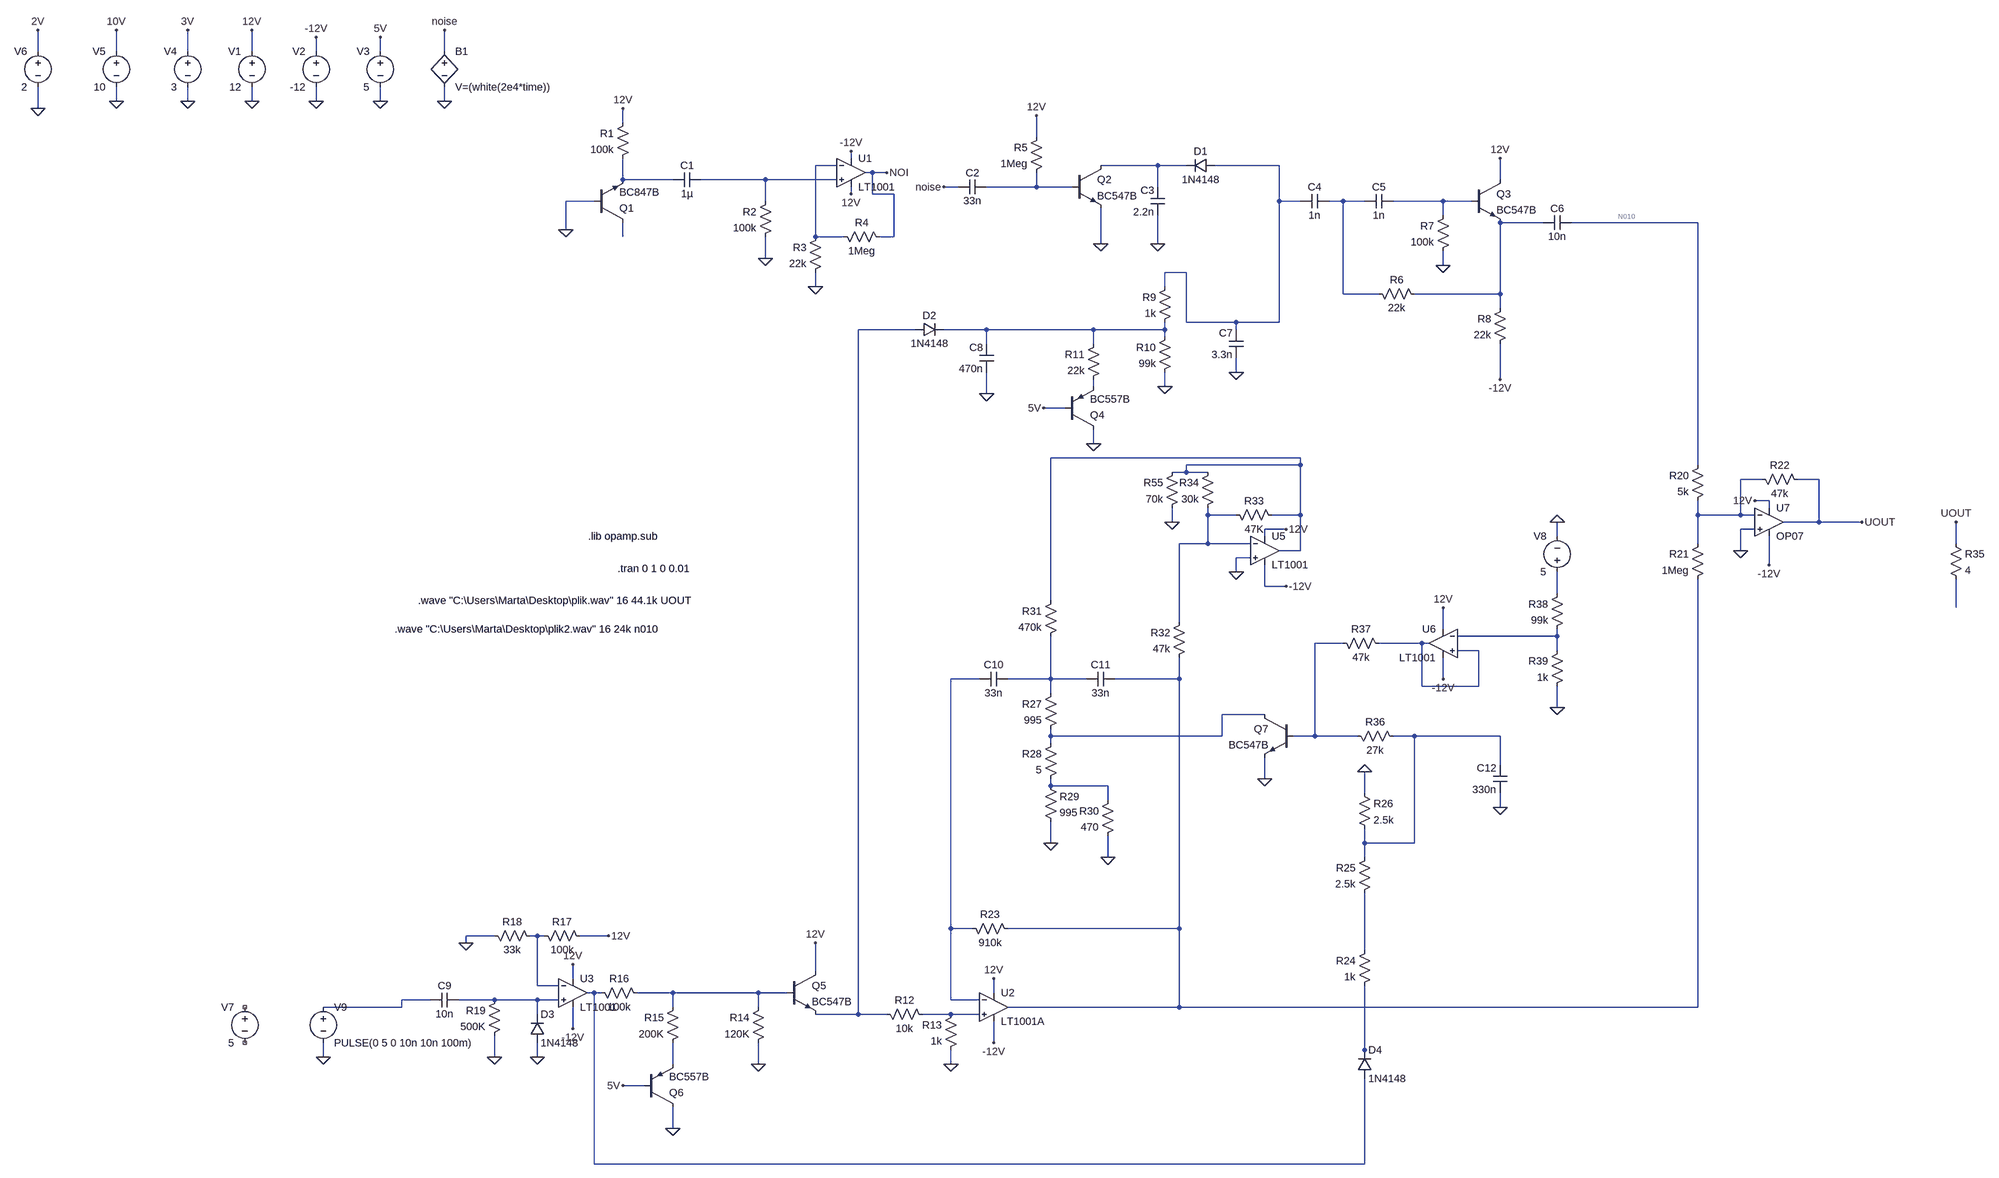
[diagram p0: schematic snare.asc]
snare.asc, the LTspice schematic file:
Version 4
SHEET 1 1432 2244
WIRE -4432 -400 -4432 -448
WIRE -4256 -400 -4256 -448
WIRE -4096 -400 -4096 -448
WIRE -3952 -400 -3952 -448
WIRE -3808 -400 -3808 -432
WIRE -3664 -400 -3664 -432
WIRE -3520 -400 -3520 -448
WIRE -4256 -288 -4256 -320
WIRE -4096 -288 -4096 -320
WIRE -3952 -288 -3952 -320
WIRE -3808 -288 -3808 -320
WIRE -3664 -288 -3664 -320
WIRE -3520 -288 -3520 -320
WIRE -4432 -272 -4432 -320
WIRE -3120 -240 -3120 -272
WIRE -2192 -208 -2192 -256
WIRE -2608 -160 -2608 -176
WIRE -2640 -144 -2688 -144
WIRE -1920 -144 -2048 -144
WIRE -1856 -144 -1920 -144
WIRE -1648 -144 -1792 -144
WIRE -2560 -128 -2576 -128
WIRE -2528 -128 -2560 -128
WIRE -3120 -112 -3120 -160
WIRE -3008 -112 -3120 -112
WIRE -2800 -112 -2944 -112
WIRE -2640 -112 -2800 -112
WIRE -1152 -112 -1152 -160
WIRE -2368 -96 -2400 -96
WIRE -2192 -96 -2192 -128
WIRE -2192 -96 -2304 -96
WIRE -2112 -96 -2192 -96
WIRE -1920 -96 -1920 -144
WIRE -2608 -80 -2608 -96
WIRE -2560 -80 -2560 -128
WIRE -2512 -80 -2560 -80
WIRE -3184 -64 -3248 -64
WIRE -2800 -64 -2800 -112
WIRE -1648 -64 -1648 -144
WIRE -1600 -64 -1648 -64
WIRE -1504 -64 -1536 -64
WIRE -1456 -64 -1504 -64
WIRE -1280 -64 -1392 -64
WIRE -1216 -64 -1280 -64
WIRE -1280 -32 -1280 -64
WIRE -1056 -16 -1152 -16
WIRE -672 -16 -992 -16
WIRE -3248 0 -3248 -64
WIRE -3120 16 -3120 -16
WIRE -2688 16 -2688 -144
WIRE -2624 16 -2688 16
WIRE -2512 16 -2512 -80
WIRE -2512 16 -2544 16
WIRE -2048 32 -2048 -48
WIRE -1920 32 -1920 -32
WIRE -2800 64 -2800 16
WIRE -1280 80 -1280 48
WIRE -1856 96 -1904 96
WIRE -2688 128 -2688 96
WIRE -1904 128 -1904 96
WIRE -1504 144 -1504 -64
WIRE -1424 144 -1504 144
WIRE -1152 144 -1152 -16
WIRE -1152 144 -1344 144
WIRE -1152 176 -1152 144
WIRE -1856 208 -1856 96
WIRE -1744 208 -1856 208
WIRE -1648 208 -1648 -64
WIRE -1648 208 -1744 208
WIRE -2464 224 -2592 224
WIRE -2304 224 -2400 224
WIRE -2064 224 -2304 224
WIRE -1904 224 -1904 208
WIRE -1904 224 -2064 224
WIRE -1744 224 -1744 208
WIRE -1904 240 -1904 224
WIRE -2304 256 -2304 224
WIRE -2064 256 -2064 224
WIRE -1744 320 -1744 288
WIRE -1152 336 -1152 256
WIRE -2064 352 -2064 336
WIRE -1904 352 -1904 320
WIRE -2304 368 -2304 320
WIRE -2128 400 -2176 400
WIRE -2064 480 -2064 448
WIRE -1600 512 -2160 512
WIRE -1600 528 -1600 512
WIRE -1600 528 -1856 528
WIRE -672 528 -672 -16
WIRE -1856 544 -1856 528
WIRE -1856 544 -1888 544
WIRE -1808 544 -1856 544
WIRE -528 560 -576 560
WIRE -400 560 -448 560
WIRE -512 608 -544 608
WIRE -512 624 -512 608
WIRE -1808 640 -1808 624
WIRE -1744 640 -1808 640
WIRE -1600 640 -1600 528
WIRE -1600 640 -1664 640
WIRE -672 640 -672 608
WIRE -576 640 -576 560
WIRE -576 640 -672 640
WIRE -544 640 -576 640
WIRE -1888 656 -1888 624
WIRE -400 656 -400 560
WIRE -400 656 -480 656
WIRE -304 656 -400 656
WIRE -1632 672 -1680 672
WIRE -544 672 -576 672
WIRE -1680 688 -1680 672
WIRE -1024 688 -1024 656
WIRE -1808 704 -1808 640
WIRE -1808 704 -1872 704
WIRE -1712 704 -1808 704
WIRE -672 704 -672 640
WIRE -16 704 -16 656
WIRE -1600 720 -1600 640
WIRE -1600 720 -1648 720
WIRE -576 720 -576 672
WIRE -1712 736 -1744 736
WIRE -512 752 -512 688
WIRE -1744 768 -1744 736
WIRE -1680 800 -1680 752
WIRE -1632 800 -1680 800
WIRE -1024 816 -1024 768
WIRE -2160 832 -2160 512
WIRE -16 848 -16 784
WIRE -1872 880 -1872 704
WIRE -1280 896 -1280 848
WIRE -1024 912 -1024 896
WIRE -1024 912 -1248 912
WIRE -1504 928 -1568 928
WIRE -1328 928 -1424 928
WIRE -1312 928 -1328 928
WIRE -1200 944 -1248 944
WIRE -1024 944 -1024 912
WIRE -2320 1008 -2384 1008
WIRE -2160 1008 -2160 912
WIRE -2160 1008 -2256 1008
WIRE -2080 1008 -2160 1008
WIRE -1872 1008 -1872 960
WIRE -1872 1008 -2016 1008
WIRE -1280 1008 -1280 960
WIRE -1328 1024 -1328 928
WIRE -1200 1024 -1200 944
WIRE -1200 1024 -1328 1024
WIRE -2160 1040 -2160 1008
WIRE -1024 1072 -1024 1024
WIRE -1680 1088 -1776 1088
WIRE -2160 1136 -2160 1120
WIRE -1776 1136 -1776 1088
WIRE -1776 1136 -2160 1136
WIRE -1568 1136 -1568 928
WIRE -1568 1136 -1616 1136
WIRE -1472 1136 -1568 1136
WIRE -1344 1136 -1392 1136
WIRE -1152 1136 -1344 1136
WIRE -2160 1152 -2160 1136
WIRE -1152 1200 -1152 1136
WIRE -1680 1232 -1680 1184
WIRE -2160 1248 -2160 1232
WIRE -2032 1248 -2160 1248
WIRE -1456 1264 -1456 1216
WIRE -2032 1280 -2032 1248
WIRE -1152 1296 -1152 1264
WIRE -2160 1376 -2160 1328
WIRE -1456 1376 -1456 1344
WIRE -1344 1376 -1344 1136
WIRE -1344 1376 -1456 1376
WIRE -2032 1408 -2032 1360
WIRE -1456 1408 -1456 1376
WIRE -2384 1568 -2384 1008
WIRE -2336 1568 -2384 1568
WIRE -1872 1568 -1872 1008
WIRE -1872 1568 -2256 1568
WIRE -3408 1584 -3472 1584
WIRE -3312 1584 -3328 1584
WIRE -3296 1584 -3312 1584
WIRE -3152 1584 -3216 1584
WIRE -3472 1600 -3472 1584
WIRE -1456 1616 -1456 1488
WIRE -2688 1664 -2688 1600
WIRE -3232 1680 -3232 1648
WIRE -3312 1696 -3312 1584
WIRE -3264 1696 -3312 1696
WIRE -3184 1712 -3200 1712
WIRE -3168 1712 -3184 1712
WIRE -3008 1712 -3088 1712
WIRE -2816 1712 -3008 1712
WIRE -2752 1712 -2816 1712
WIRE -2288 1712 -2288 1680
WIRE -3552 1728 -3616 1728
WIRE -3408 1728 -3488 1728
WIRE -3312 1728 -3408 1728
WIRE -3264 1728 -3312 1728
WIRE -2384 1728 -2384 1568
WIRE -2320 1728 -2384 1728
WIRE -3616 1744 -3616 1728
WIRE -3616 1744 -3792 1744
WIRE -3008 1744 -3008 1712
WIRE -2816 1744 -2816 1712
WIRE -1872 1744 -1872 1568
WIRE -1872 1744 -2256 1744
WIRE -672 1744 -672 784
WIRE -672 1744 -1872 1744
WIRE -3312 1760 -3312 1728
WIRE -2592 1760 -2592 224
WIRE -2592 1760 -2688 1760
WIRE -2528 1760 -2592 1760
WIRE -2384 1760 -2448 1760
WIRE -2320 1760 -2384 1760
WIRE -3232 1792 -3232 1744
WIRE -2288 1824 -2288 1776
WIRE -1456 1840 -1456 1696
WIRE -3792 1856 -3792 1824
WIRE -3408 1856 -3408 1808
WIRE -3312 1856 -3312 1824
WIRE -1456 1856 -1456 1840
WIRE -3008 1872 -3008 1824
WIRE -2816 1872 -2816 1824
WIRE -2384 1872 -2384 1840
WIRE -3072 1920 -3120 1920
WIRE -3008 2016 -3008 1968
WIRE -3184 2096 -3184 1712
WIRE -1456 2096 -1456 1904
WIRE -1456 2096 -3184 2096
FLAG -3248 0 0
FLAG -3952 -288 0
FLAG -3952 -448 12V
FLAG -3120 -272 12V
FLAG -2800 64 0
FLAG -2688 128 0
FLAG -2192 -256 12V
FLAG -2048 32 0
FLAG -1920 32 0
FLAG -1280 80 0
FLAG -1152 -160 12V
FLAG -3808 -288 0
FLAG -3808 -432 -12V
FLAG -1152 336 -12V
FLAG -1744 320 0
FLAG -1904 352 0
FLAG -3664 -288 0
FLAG -3664 -432 5V
FLAG -2064 480 0
FLAG -2176 400 5V
FLAG -2304 368 0
FLAG -2384 1872 0
FLAG -2688 1600 12V
FLAG -2816 1872 0
FLAG -3008 2016 0
FLAG -3120 1920 5V
FLAG -4096 -288 0
FLAG -4096 -448 3V
FLAG -3152 1584 12V
FLAG -3472 1600 0
FLAG -3312 1856 0
FLAG -3408 1856 0
FLAG -4256 -288 0
FLAG -4256 -448 10V
FLAG -576 720 0
FLAG -304 656 UOUT
FLAG -2032 1408 0
FLAG -1744 768 0
FLAG -1888 656 0
FLAG -1152 1296 0
FLAG -1680 1232 0
FLAG -1024 1072 0
FLAG -4432 -272 0
FLAG -4432 -448 2V
FLAG -3792 1856 0
FLAG -1024 656 0
FLAG -3520 -288 0
FLAG -3520 -448 noise
FLAG -1280 848 12V
FLAG -1280 1008 -12V
FLAG -544 608 12V
FLAG -512 752 -12V
FLAG -2288 1680 12V
FLAG -2288 1824 -12V
FLAG -3232 1648 12V
FLAG -3232 1792 -12V
FLAG -1632 672 12V
FLAG -1632 800 -12V
FLAG -2608 -176 -12V
FLAG -2608 -80 12V
FLAG -2400 -96 noise
FLAG -1456 1216 0
FLAG -2160 1376 0
FLAG -2528 -128 NOI
FLAG -16 656 UOUT
SYMBOL npn -3184 -16 M180
SYMATTR InstName Q1
SYMATTR Value BC847B
SYMBOL res -3104 -256 M0
SYMATTR InstName R1
SYMATTR Value 100k
SYMBOL voltage -3952 -416 M0
WINDOW 123 0 0 Left 0
WINDOW 39 0 0 Left 0
SYMATTR InstName V1
SYMATTR Value 12
SYMBOL cap -3008 -128 M90
WINDOW 0 0 32 VBottom 2
WINDOW 3 32 32 VTop 2
SYMATTR InstName C1
SYMATTR Value 1µ
SYMBOL res -2784 -80 M0
SYMATTR InstName R2
SYMATTR Value 100k
SYMBOL res -2672 0 M0
SYMATTR InstName R3
SYMATTR Value 22k
SYMBOL res -2640 0 M90
WINDOW 0 0 56 VBottom 2
WINDOW 3 32 56 VTop 2
SYMATTR InstName R4
SYMATTR Value 1Meg
SYMBOL cap -2368 -112 M90
WINDOW 0 0 32 VBottom 2
WINDOW 3 32 32 VTop 2
SYMATTR InstName C2
SYMATTR Value 33n
SYMBOL res -2176 -224 M0
SYMATTR InstName R5
SYMATTR Value 1Meg
SYMBOL npn -2112 -144 R0
SYMATTR InstName Q2
SYMATTR Value BC547B
SYMBOL diode -1792 -128 M270
WINDOW 0 32 32 VTop 2
WINDOW 3 0 32 VBottom 2
SYMATTR InstName D1
SYMATTR Value 1N4148
SYMBOL cap -1904 -96 M0
SYMATTR InstName C3
SYMATTR Value 2.2n
SYMBOL cap -1600 -80 M90
WINDOW 0 0 32 VBottom 2
WINDOW 3 32 32 VTop 2
SYMATTR InstName C4
SYMATTR Value 1n
SYMBOL cap -1456 -80 M90
WINDOW 0 0 32 VBottom 2
WINDOW 3 32 32 VTop 2
SYMATTR InstName C5
SYMATTR Value 1n
SYMBOL res -1440 128 M90
WINDOW 0 0 56 VBottom 2
WINDOW 3 32 56 VTop 2
SYMATTR InstName R6
SYMATTR Value 22k
SYMBOL res -1264 -48 M0
SYMATTR InstName R7
SYMATTR Value 100k
SYMBOL npn -1216 -112 R0
SYMATTR InstName Q3
SYMATTR Value BC547B
SYMBOL voltage -3808 -416 M0
WINDOW 123 0 0 Left 0
WINDOW 39 0 0 Left 0
SYMATTR InstName V2
SYMATTR Value -12
SYMBOL cap -1056 -32 M90
WINDOW 0 0 32 VBottom 2
WINDOW 3 32 32 VTop 2
SYMATTR InstName C6
SYMATTR Value 10n
SYMBOL res -1136 160 M0
SYMATTR InstName R8
SYMATTR Value 22k
SYMBOL cap -1728 224 M0
SYMATTR InstName C7
SYMATTR Value 3.3n
SYMBOL res -1888 112 M0
SYMATTR InstName R9
SYMATTR Value 1k
SYMBOL res -1888 224 M0
SYMATTR InstName R10
SYMATTR Value 99k
SYMBOL res -2048 240 M0
SYMATTR InstName R11
SYMATTR Value 22k
SYMBOL voltage -3664 -416 M0
WINDOW 123 0 0 Left 0
WINDOW 39 0 0 Left 0
SYMATTR InstName V3
SYMATTR Value 5
SYMBOL pnp -2128 448 M180
SYMATTR InstName Q4
SYMATTR Value BC557B
SYMBOL cap -2288 256 M0
SYMATTR InstName C8
SYMATTR Value 470n
SYMBOL diode -2464 208 M90
WINDOW 0 0 32 VBottom 2
WINDOW 3 32 32 VTop 2
SYMATTR InstName D2
SYMATTR Value 1N4148
SYMBOL res -2544 1744 M90
WINDOW 0 0 56 VBottom 2
WINDOW 3 32 56 VTop 2
SYMATTR InstName R12
SYMATTR Value 10k
SYMBOL res -2368 1744 M0
SYMATTR InstName R13
SYMATTR Value 1k
SYMBOL npn -2752 1664 R0
SYMATTR InstName Q5
SYMATTR Value BC547B
SYMBOL res -2800 1728 M0
SYMATTR InstName R14
SYMATTR Value 120K
SYMBOL res -2992 1728 M0
SYMATTR InstName R15
SYMATTR Value 200K
SYMBOL pnp -3072 1968 M180
SYMATTR InstName Q6
SYMATTR Value BC557B
SYMBOL voltage -4096 -416 M0
WINDOW 123 0 0 Left 0
WINDOW 39 0 0 Left 0
SYMATTR InstName V4
SYMATTR Value 3
SYMBOL res -3184 1696 M90
WINDOW 0 0 56 VBottom 2
WINDOW 3 32 56 VTop 2
SYMATTR InstName R16
SYMATTR Value 100k
SYMBOL res -3312 1568 M90
WINDOW 0 0 56 VBottom 2
WINDOW 3 32 56 VTop 2
SYMATTR InstName R17
SYMATTR Value 100k
SYMBOL res -3424 1568 M90
WINDOW 0 0 56 VBottom 2
WINDOW 3 32 56 VTop 2
SYMATTR InstName R18
SYMATTR Value 33k
SYMBOL diode -3328 1824 M180
WINDOW 0 24 64 Left 2
WINDOW 3 24 0 Left 2
SYMATTR InstName D3
SYMATTR Value 1N4148
SYMBOL res -3392 1712 M0
SYMATTR InstName R19
SYMATTR Value 500K
SYMBOL cap -3552 1712 M90
WINDOW 0 0 32 VBottom 2
WINDOW 3 32 32 VTop 2
SYMATTR InstName C9
SYMATTR Value 10n
SYMBOL voltage -4256 -416 M0
WINDOW 123 0 0 Left 0
WINDOW 39 0 0 Left 0
SYMATTR InstName V5
SYMATTR Value 10
SYMBOL diode -1472 1904 M180
WINDOW 0 24 64 Left 2
WINDOW 3 24 0 Left 2
SYMATTR InstName D4
SYMATTR Value 1N4148
SYMBOL res -656 512 M0
SYMATTR InstName R20
SYMATTR Value 5k
SYMBOL res -656 688 M0
SYMATTR InstName R21
SYMATTR Value 1Meg
SYMBOL res -544 544 M90
WINDOW 0 0 56 VBottom 2
WINDOW 3 32 56 VTop 2
SYMATTR InstName R22
SYMATTR Value 47k
SYMBOL res -2352 1552 M90
WINDOW 0 0 56 VBottom 2
WINDOW 3 32 56 VTop 2
SYMATTR InstName R23
SYMATTR Value 910k
SYMBOL res -1440 1600 M0
SYMATTR InstName R24
SYMATTR Value 1k
SYMBOL res -1440 1392 M0
SYMATTR InstName R25
SYMATTR Value 2.5k
SYMBOL cap -2320 992 M90
WINDOW 0 0 32 VBottom 2
WINDOW 3 32 32 VTop 2
SYMATTR InstName C10
SYMATTR Value 33n
SYMBOL cap -2080 992 M90
WINDOW 0 0 32 VBottom 2
WINDOW 3 32 32 VTop 2
SYMATTR InstName C11
SYMATTR Value 33n
SYMBOL res -2144 1024 M0
SYMATTR InstName R27
SYMATTR Value 995
SYMBOL res -2144 1136 M0
SYMATTR InstName R28
SYMATTR Value 5
SYMBOL res -2016 1264 M0
SYMATTR InstName R30
SYMATTR Value 470
SYMBOL res -2144 816 M0
SYMATTR InstName R31
SYMATTR Value 470k
SYMBOL res -1856 864 M0
SYMATTR InstName R32
SYMATTR Value 47k
SYMBOL res -1760 624 M90
WINDOW 0 0 56 VBottom 2
WINDOW 3 32 56 VTop 2
SYMATTR InstName R33
SYMATTR Value 47K
SYMBOL res -1792 528 M0
SYMATTR InstName R34
SYMATTR Value 30k
SYMBOL res -1872 528 M0
SYMATTR InstName R55
SYMATTR Value 70k
SYMBOL res -1488 1120 M90
WINDOW 0 0 56 VBottom 2
WINDOW 3 32 56 VTop 2
SYMATTR InstName R36
SYMATTR Value 27k
SYMBOL cap -1136 1200 M0
SYMATTR InstName C12
SYMATTR Value 330n
SYMBOL res -1520 912 M90
WINDOW 0 0 56 VBottom 2
WINDOW 3 32 56 VTop 2
SYMATTR InstName R37
SYMATTR Value 47k
SYMBOL npn -1616 1088 M0
SYMATTR InstName Q7
SYMATTR Value BC547B
SYMBOL res -1008 800 M0
SYMATTR InstName R38
SYMATTR Value 99k
SYMBOL res -1008 928 M0
SYMATTR InstName R39
SYMATTR Value 1k
SYMBOL voltage -4432 -416 M0
WINDOW 123 0 0 Left 0
WINDOW 39 0 0 Left 0
SYMATTR InstName V6
SYMATTR Value 2
SYMBOL voltage -3968 1728 M0
WINDOW 123 0 0 Left 0
WINDOW 39 0 0 Left 0
SYMATTR InstName V7
SYMATTR Value 5
SYMBOL voltage -1024 784 R180
WINDOW 0 24 96 Left 2
WINDOW 3 24 16 Left 2
WINDOW 123 0 0 Left 0
WINDOW 39 0 0 Left 0
SYMATTR InstName V8
SYMATTR Value 5
SYMBOL bv -3520 -416 R0
SYMATTR InstName B1
SYMATTR Value V=(white(2e4*time))
SYMBOL OpAmps\\LT1001 -1280 864 M0
SYMATTR InstName U6
SYMBOL OpAmps\\LT1001 -3232 1648 R0
SYMATTR InstName U3
SYMBOL OpAmps\\LT1001 -1680 656 R0
SYMATTR InstName U5
SYMBOL OpAmps\\LT1001A -2288 1680 R0
SYMATTR InstName U2
SYMBOL res -1472 1248 R0
SYMATTR InstName R26
SYMATTR Value 2.5k
SYMBOL res -2176 1232 R0
SYMATTR InstName R29
SYMATTR Value 995
SYMBOL voltage -3792 1728 R0
WINDOW 123 0 0 Left 0
WINDOW 39 0 0 Left 0
SYMATTR InstName V9
SYMATTR Value PULSE(0 5 0 10n 10n 100m)
SYMBOL OpAmps\\LT1001 -2608 -192 R0
SYMATTR InstName U1
SYMBOL res -32 688 R0
SYMATTR InstName R35
SYMATTR Value 4
SYMBOL OpAmps\\OP07 -512 592 R0
SYMATTR InstName U7
TEXT -2968 832 Right 2 !.wave "C:\\Users\\Marta\\Desktop\\plik.wav" 16 44.1k UOUT
TEXT -3040 688 Right 2 !.lib opamp.sub
TEXT -2968 760 Right 2 !.tran 0 1 0 0.01
TEXT -3632 896 Left 2 !.wave "C:\\Users\\Marta\\Desktop\\plik2.wav" 16 24k n010

The netlist it stands for:
* snare.asc
Q1 N011 0 N004 0 BC847B
R1 12V N004 100k
V1 12V 0 12
C1 N004 N005 1µ
R2 N005 0 100k
R3 N001 0 22k
R4 N001 NOI 1Meg
C2 noise N006 33n
R5 12V N006 1Meg
Q2 N002 N006 0 0 BC547B
D1 N003 N002 1N4148
C3 N002 0 2.2n
C4 N003 N007 1n
C5 N007 N008 1n
R6 N007 N009 22k
R7 N008 0 100k
Q3 12V N008 N009 0 BC547B
V2 -12V 0 -12
C6 N009 N010 10n
R8 N009 -12V 22k
C7 N003 0 3.3n
R9 N003 N013 1k
R10 N013 0 99k
R11 N013 N014 22k
V3 5V 0 5
Q4 0 5V N014 0 BC557B
C8 N013 0 470n
D2 N012 N013 1N4148
R12 N012 N035 10k
R13 N035 0 1k
Q5 12V N032 N012 0 BC547B
R14 N032 0 120K
R15 N032 N037 200K
Q6 0 5V N037 0 BC557B
V4 3V 0 3
R16 N031 N032 100k
R17 N029 12V 100k
R18 0 N029 33k
D3 0 N034 1N4148
R19 N034 0 500K
C9 N033 N034 10n
V5 10V 0 10
D4 N031 N036 1N4148
R20 N010 N016 5k
R21 N016 N025 1Meg
R22 N016 UOUT 47k
R23 N023 N025 910k
R24 N030 N036 1k
R25 N027 N030 2.5k
C10 N023 N024 33n
C11 N024 N025 33n
R27 N024 N026 995
R28 N026 N028 5
R30 N028 0 470
R31 N015 N024 470k
R32 N017 N025 47k
R33 N017 N015 47K
R34 N015 N017 30k
R55 N015 0 70k
R36 N021 N027 27k
C12 N027 0 330n
R37 N021 N022 47k
Q7 N026 N021 0 0 BC547B
R38 N018 N020 99k
R39 N020 0 1k
V6 2V 0 2
V7 NC_01 NC_02 5
V8 N018 0 5
B1 noise 0 V=(white(2e4*time))
XU6 N022 N020 12V -12V N022 LT1001  ; pins In+ In- V+ V- OUT
XU3 N034 N029 12V -12V N031 LT1001  ; pins In+ In- V+ V- OUT
XU5 0 N017 12V -12V N015 LT1001  ; pins In+ In- V+ V- OUT
XU2 N035 N023 12V -12V N025 LT1001  ; LT1001A, pins In+ In- V+ V- OUT
R26 0 N027 2.5k
R29 N028 0 995
V9 N033 0 PULSE(0 5 0 10n 10n 100m)
XU1 N005 N001 -12V 12V NOI LT1001  ; pins In+ In- V+ V- OUT
R35 UOUT N019 4
XU7 0 N016 12V -12V UOUT LT1001  ; OP07, pins In+ In- V+ V- OUT
.model D D
.lib standard.dio
.model NPN NPN
.model PNP PNP
.lib standard.bjt
.wave "C:\Users\Marta\Desktop\plik.wav" 16 44.1k UOUT
.lib opamp.sub
.tran 0 1 0 0.01
.wave "C:\Users\Marta\Desktop\plik2.wav" 16 24k n010
.lib LTC.lib
.backanno
.end